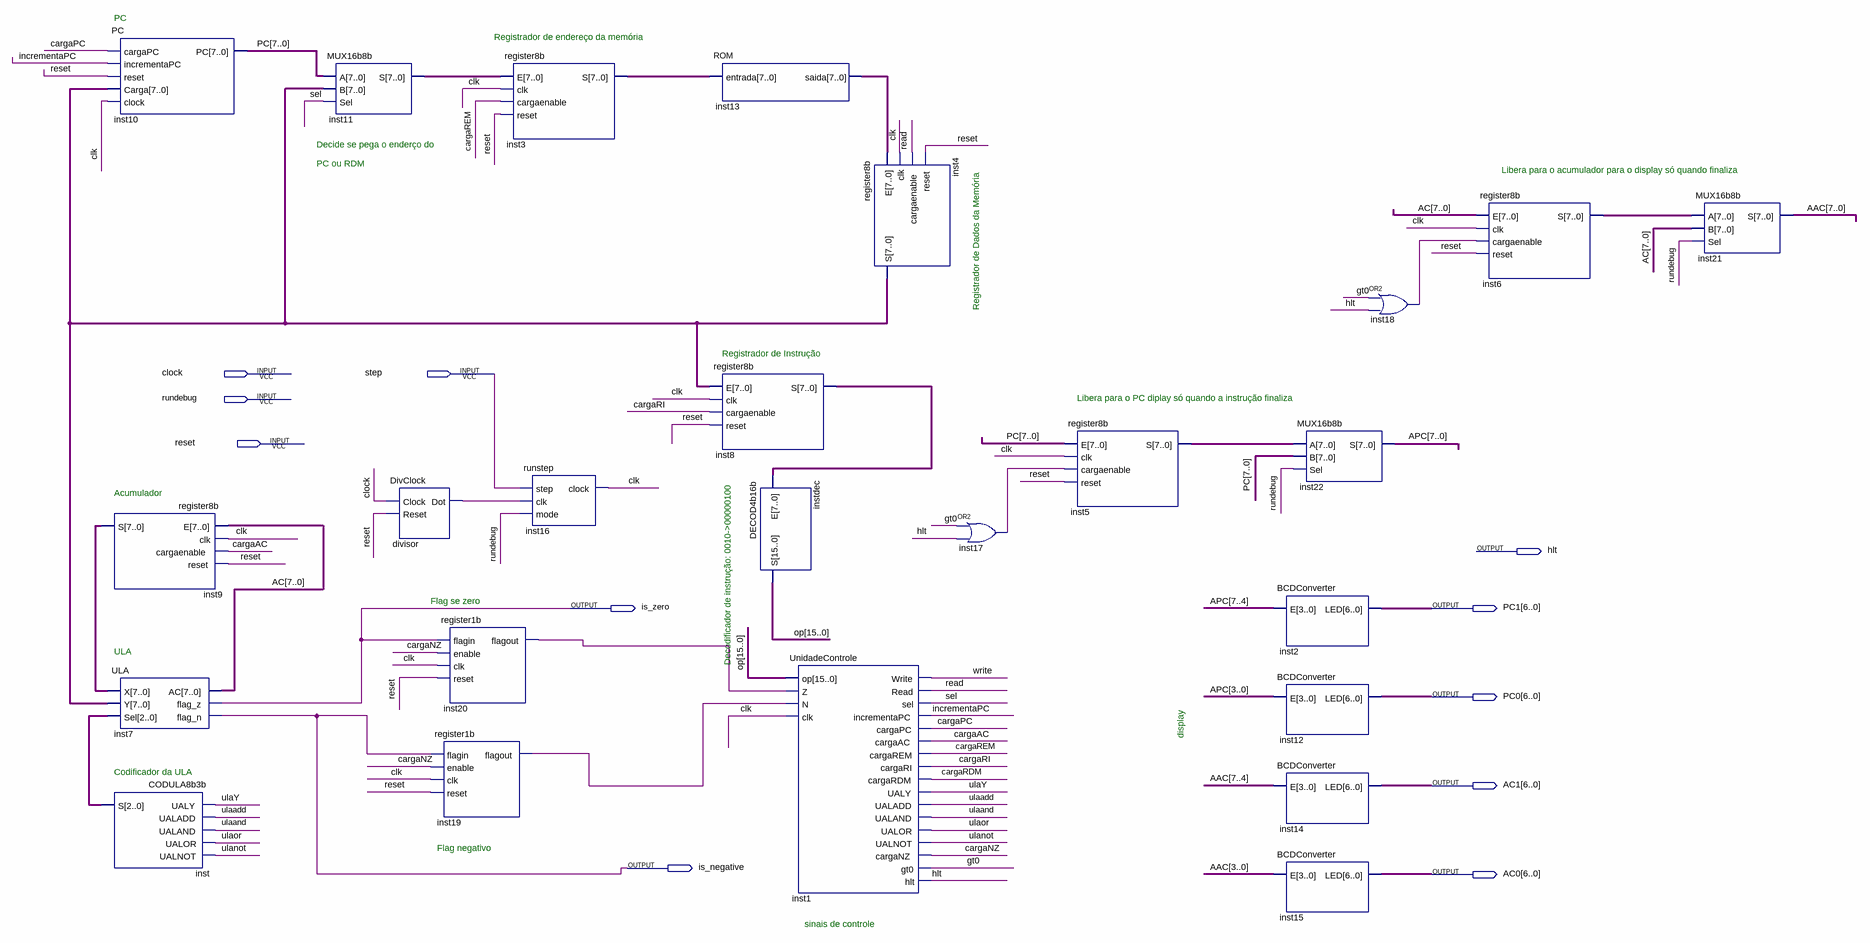
[diagram p0: schematic sheet]
// Quartus schematic neander.bdf as structural Verilog: 25 symbols, 11 pins
module neander (
  input  clock,
  input  step,
  input  rundebug,
  input  reset,
  output hlt,
  output is_zero,
  output [6:0] PC1,
  output [6:0] PC0,
  output [6:0] AC1,
  output is_negative,
  output [6:0] AC0
);

  wire cargaAC, cargaNZ, cargaPC, cargaRDM, cargaREM, cargaRI, clk, divisor_dot, gt0, incrementaPC,
       inst17_out, inst18_out, inst19_flagout, inst20_flagout, read, sel, ulaadd, ulaand, ulanot, ulaor,
       ulaY, write;
  wire [2:0] inst_s;
  wire [7:0] AAC, AC, APC, inst3_s, inst4_s, inst5_s, inst6_s, inst8_s, inst9_s, inst11_s, inst13_saida, PC;
  wire [15:0] op;

  PC inst10 (.cargaPC(cargaPC), .incrementaPC(incrementaPC), .reset(reset), .Carga(inst4_s), .clock(clk), .PC(PC));
  register8b inst9 (.E(AC), .clk(clk), .cargaenable(cargaAC), .reset(reset), .S(inst9_s));
  ULA inst7 (.X(inst9_s), .Y(inst4_s), .Sel(inst_s), .AC(AC), .flag_z(is_zero), .flag_n(is_negative));
  CODULA8b3b inst (.UALY(ulaY), .UALADD(ulaadd), .UALAND(ulaand), .UALOR(ulaor), .UALNOT(ulanot), .S(inst_s));
  MUX16b8b inst11 (.A(PC), .B(inst4_s), .Sel(sel), .S(inst11_s));
  DivClock divisor (.Clock(clock), .Reset(reset), .Dot(divisor_dot));
  register1b inst20 (.flagin(is_zero), .enable(cargaNZ), .clk(clk), .reset(reset), .flagout(inst20_flagout));
  register1b inst19 (.flagin(is_negative), .enable(cargaNZ), .clk(clk), .reset(reset), .flagout(inst19_flagout));
  register8b inst3 (.E(inst11_s), .clk(clk), .cargaenable(cargaREM), .reset(reset), .S(inst3_s));
  runstep inst16 (.step(step), .clk(divisor_dot), .mode(rundebug), .clock(clk));
  ROM inst13 (.entrada(inst3_s), .saida(inst13_saida));
  register8b inst8 (.E(inst4_s), .clk(clk), .cargaenable(cargaRI), .reset(reset), .S(inst8_s));
  DECOD4b16b instdec (.E(inst8_s), .S(op));
  UnidadeControle inst1 (
    .op(op), .Z(inst20_flagout), .N(inst19_flagout), .clk(clk), .Write(write), .Read(read), .sel(sel),
    .incrementaPC(incrementaPC), .cargaPC(cargaPC), .cargaAC(cargaAC), .cargaREM(cargaREM),
    .cargaRI(cargaRI), .cargaRDM(cargaRDM), .UALY(ulaY), .UALADD(ulaadd), .UALAND(ulaand), .UALOR(ulaor),
    .UALNOT(ulanot), .cargaNZ(cargaNZ), .gt0(gt0), .hlt(hlt));
  register8b inst4 (.E(inst13_saida), .clk(clk), .cargaenable(read), .reset(reset), .S(inst4_s));
  or inst17 (inst17_out, gt0, hlt);
  register8b inst5 (.E(PC), .clk(clk), .cargaenable(inst17_out), .reset(reset), .S(inst5_s));
  MUX16b8b inst22 (.A(inst5_s), .B(PC), .Sel(rundebug), .S(APC));
  BCDConverter inst2 (.E(APC[7:4]), .LED(PC1));
  BCDConverter inst12 (.E(APC[3:0]), .LED(PC0));
  BCDConverter inst14 (.E(AAC[7:4]), .LED(AC1));
  BCDConverter inst15 (.E(AAC[3:0]), .LED(AC0));
  or inst18 (inst18_out, gt0, hlt);
  register8b inst6 (.E(AC), .clk(clk), .cargaenable(inst18_out), .reset(reset), .S(inst6_s));
  MUX16b8b inst21 (.A(inst6_s), .B(AC), .Sel(rundebug), .S(AAC));

  // Notes on the sheet:
  //   PC
  //   Registrador de endereço da memória
  //   Decide se pega o enderço do
  //   PC ou RDM
  //   Registrador de Dados da Memória
  //   Libera para o acumulador para o display só quando finaliza
  //   Registrador de Instrução
  //   Libera para o PC diplay só quando a instrução finaliza
  //   Decodificador de instrução: 0010->00000100
  //   Acumulador
  //   Flag se zero
  //   ULA
  //   display
  //   Codificador da ULA
  //   Flag negativo
  //   sinais de controle
endmodule
